# Altium schematic sheet SHEET_MAIN.SchDoc
size 381 x 241 mm
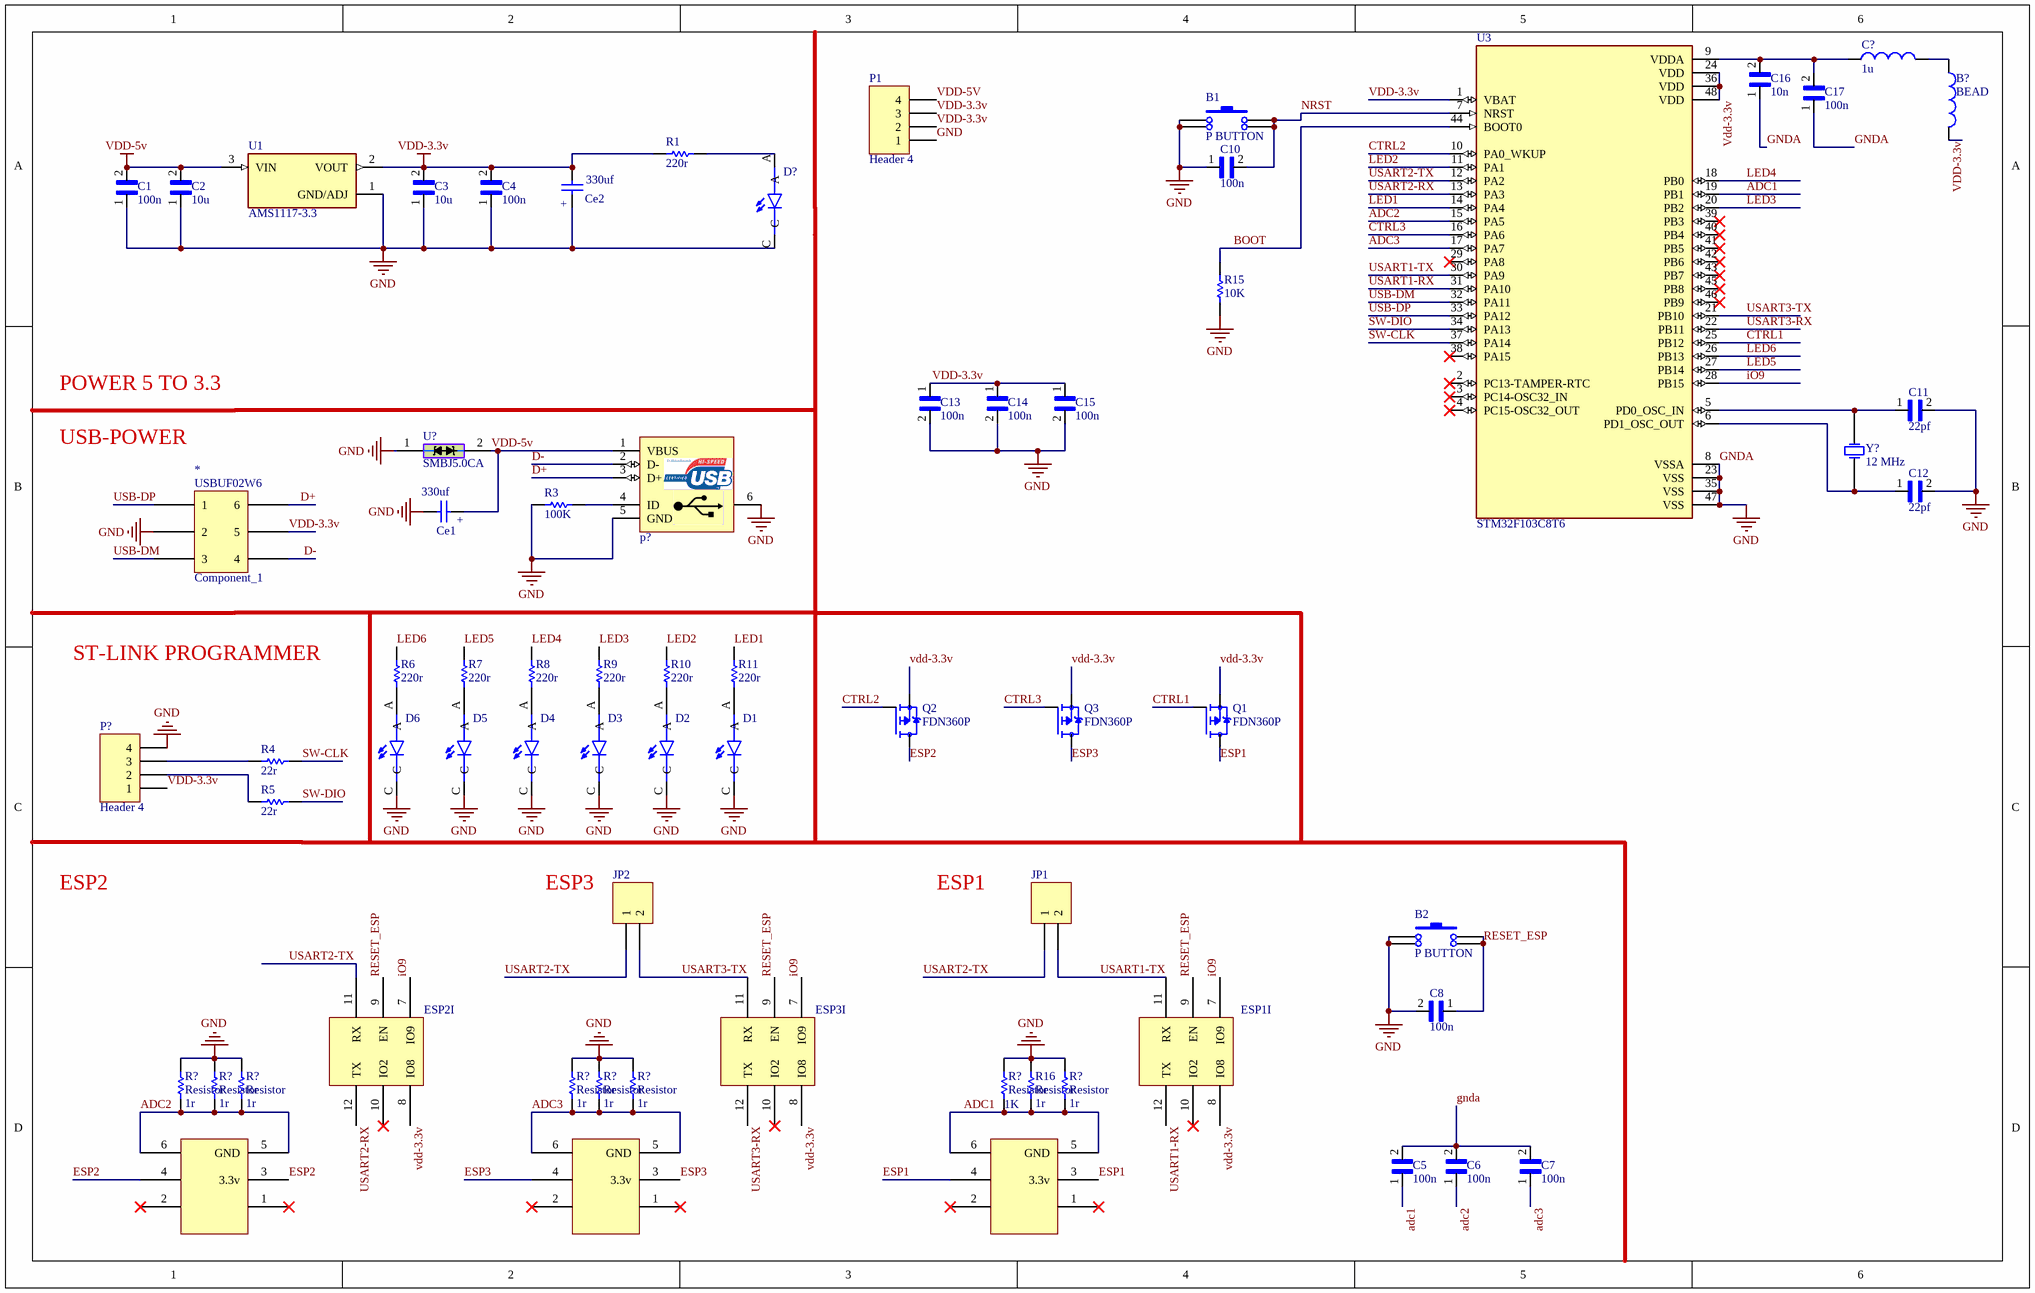
[diagram p0: SHEET_MAIN.SchDoc]

## Parts
(Parts that share a designator on the sheet are numbered #1, #2 ... from top to bottom, then left to right.)
*  Component_1  [PCBComponent_1]
B1  P BUTTON  [SMD_PUSH_4PIN]
B2  P BUTTON  [SMD_PUSH_4PIN]
B?  BEAD  [RES 0805 (2012X06L)]
C1  100n  [CAPC2012X145N]
C2  10u  [CAPC2012X145N]
C3  10u  [CAPC2012X145N]
C4  100n  [CAPC2012X145N]
C5  100n  [CAPC2012X145N]
C6  100n  [CAPC2012X145N]
C7  100n  [CAPC2012X145N]
C8  100n  [CAPC2012X145N]
C10  100n  [CAPC2012X145N]
C11  22pf  [CAPC2012X145N]
C12  22pf  [CAPC2012X145N]
C13  100n  [CAPC2012X145N]
C14  100n  [CAPC2012X145N]
C15  100n  [CAPC2012X145N]
C16  10n  [CAPC2012X145N]
C17  100n  [CAPC2012X145N]
C?  1u  [IND0805]
Ce1  330uf  [MY_CAP_POL 8MM]
Ce2  330uf  [MY_CAP_POL 8MM]
D1  SML-LXT0805IW-TR  [LEDC2012X120N]  (value not drawn)
D2  SML-LXT0805IW-TR  [LEDC2012X120N]  (value not drawn)
D3  SML-LXT0805IW-TR  [LEDC2012X120N]  (value not drawn)
D4  SML-LXT0805IW-TR  [LEDC2012X120N]  (value not drawn)
D5  SML-LXT0805IW-TR  [LEDC2012X120N]  (value not drawn)
D6  SML-LXT0805IW-TR  [LEDC2012X120N]  (value not drawn)
D?  SML-LXT0805IW-TR  [LEDC2012X120N]  (value not drawn)
ESP1  (no value)  [PCBComponent_1]  (part I of 9)
ESP2  (no value)  [PCBComponent_1]  (part I of 9)
ESP3  (no value)  [PCBComponent_1]  (part I of 9)
JP1  Jumper 2Pin  [Jumper Small - 2.54 - Black]  (value not drawn)
JP2  Jumper 2Pin  [Jumper Small - 2.54 - Black]  (value not drawn)
P1  Header 4  [HDR1X4]
p?#1  USB Connector  [USB_AB_receptacle]  (value not drawn)
P?#2  Header 4  [HDR1X4]
Q1  FDN360P  [SOT95P251X112-3N]
Q2  FDN360P  [SOT95P251X112-3N]
Q3  FDN360P  [SOT95P251X112-3N]
R1  value 220r  [Resistor_SMD_0805]  (hidden comment: Resistor 0.25w)
R3  value 100K  [Resistor_SMD_0805]  (hidden comment: Resistor 0.25w)
R4  value 22r  [Resistor_SMD_0805]  (hidden comment: Resistor 0.25w)
R5  value 22r  [Resistor_SMD_0805]  (hidden comment: Resistor 0.25w)
R6  value 220r  [Resistor_SMD_0805]  (hidden comment: Resistor 0.25w)
R7  value 220r  [Resistor_SMD_0805]  (hidden comment: Resistor 0.25w)
R8  value 220r  [Resistor_SMD_0805]  (hidden comment: Resistor 0.25w)
R9  value 220r  [Resistor_SMD_0805]  (hidden comment: Resistor 0.25w)
R10  value 220r  [Resistor_SMD_0805]  (hidden comment: Resistor 0.25w)
R11  value 220r  [Resistor_SMD_0805]  (hidden comment: Resistor 0.25w)
R15  value 10K  [Resistor_SMD_0805]  (hidden comment: Resistor 0.25w)
R16  Resistor  value 1r  [Resistor_SMD_1206 (3216)]
R?#1  Resistor  value 1r  [Resistor_SMD_1206 (3216)]
R?#2  Resistor  value 1r  [Resistor_SMD_1206 (3216)]
R?#3  Resistor  value 1r  [Resistor_SMD_1206 (3216)]
R?#4  Resistor  value 1r  [Resistor_SMD_1206 (3216)]
R?#5  Resistor  value 1r  [Resistor_SMD_1206 (3216)]
R?#6  Resistor  value 1r  [Resistor_SMD_1206 (3216)]
R?#7  Resistor  value 1K  [Resistor_SMD_1206 (3216)]
R?#8  Resistor  value 1r  [Resistor_SMD_1206 (3216)]
U1  AMS1117-3.3  [SOT229P700X180-4N]
U3  STM32F103C8T6  [QFP50P900X900X160-48N]
U?  SMBJ5.0CA  [DO-214AC]
Y?  12 MHz  [Crystal SMD]

## Nets
GND: *.?2(2) B1.1 B1.4 B2.1 B2.4 C1.1 C2.1 C3.1 C4.1 C5.2 C6.2 C7.2 C8.2 C10.1 C11.2 C12.2 C13.2 C14.2 C15.2 C16.1 C17.1 Ce1.- Ce2.+ D1.C D2.C D3.C D4.C D5.C D6.C D?.C P1.1 p?#1.5(GND) p?#1.6(MH) P?#2.4 R3.1 R15.1 R16.2 R?#1.2 R?#2.2 R?#3.2 R?#4.2 R?#5.2 R?#6.2 R?#7.2 R?#8.2 U1.1(GND/ADJ) U3.8(VSSA) U3.23(VSS) U3.35(VSS) U3.47(VSS) U?.1  [also labelled GNDA]
VDD-3.3v: *.?5(5) B?.2 C3.2 C4.2 C13.1 C14.1 C15.1 Ce2.- ESP1.8(IO8) ESP2.8(IO8) ESP3.8(IO8) P1.2 P1.3 P?#2.1 Q1.2(S) Q2.2(S) Q3.2(S) R1.1 U1.2(VOUT) U3.1(VBAT) U3.24(VDD) U3.36(VDD) U3.48(VDD)
VDD-5v: C1.2 C2.2 Ce1.+ P1.4 p?#1.1(VBUS) U1.3(VIN) U?.2
ADC1: C5.1 ESP1.5(GND) ESP1.6 R16.1 R?#7.1 R?#8.1 U3.19(PB1)
ADC2: C6.1 ESP2.5(GND) ESP2.6 R?#1.1 R?#2.1 R?#3.1 U3.15(PA5)
ADC3: C7.1 ESP3.5(GND) ESP3.6 R?#4.1 R?#5.1 R?#6.1 U3.17(PA7)
BOOT: R15.2 U3.44(BOOT0)
CTRL1: Q1.1(G) U3.25(PB12)
CTRL2: Q2.1(G) U3.10(PA0_WKUP)
CTRL3: Q3.1(G) U3.16(PA6)
D+: *.?6(6) p?#1.3(D+)
D-: *.?4(4) p?#1.2(D-)
ESP1: ESP1.3(3.3v) ESP1.4 Q1.3(D)
ESP2: ESP2.3(3.3v) ESP2.4 Q2.3(D)
ESP3: ESP3.3(3.3v) ESP3.4 Q3.3(D)
iO9: ESP1.7(IO9) ESP2.7(IO9) ESP3.7(IO9) U3.28(PB15)
LED1: R11.2 U3.14(PA4)
LED2: R10.2 U3.11(PA1)
LED3: R9.2 U3.20(PB2)
LED4: R8.2 U3.18(PB0)
LED5: R7.2 U3.27(PB14)
LED6: R6.2 U3.26(PB13)
NRST: B1.2 B1.3 C10.2 U3.7(NRST)
RESET_ESP: B2.2 B2.3 C8.1 ESP1.9(EN) ESP2.9(EN) ESP3.9(EN)
SW-CLK: R4.2 U3.37(PA14)
SW-DIO: R5.2 U3.34(PA13)
USART1-RX: ESP1.12(TX) U3.31(PA10)
USART1-TX: ESP1.11(RX) JP1.2 U3.30(PA9)
USART2-RX: ESP2.12(TX) U3.13(PA3)
USART2-TX: ESP2.11(RX) JP1.1 JP2.1 U3.12(PA2)
USART3-RX: ESP3.12(TX) U3.22(PB11)
USART3-TX: ESP3.11(RX) JP2.2 U3.21(PB10)
USB-DM: *.?3(3) U3.32(PA11)
USB-DP: *.?1(1) U3.33(PA12)
NetB?_1: B?.1 C?.2
NetC11_1: C11.1 U3.5(PD0_OSC_IN) Y?.2(OSC2)
NetC12_1: C12.1 U3.6(PD1_OSC_OUT) Y?.1(OSC1)
NetC16_2: C16.2 C17.2 C?.1 U3.9(VDDA)
NetD1_A: D1.A R11.1
NetD2_A: D2.A R10.1
NetD3_A: D3.A R9.1
NetD4_A: D4.A R8.1
NetD5_A: D5.A R7.1
NetD6_A: D6.A R6.1
NetD?_A: D?.A R1.2
Netp?#1_4: p?#1.4(ID) R3.2
NetP?#2_2: P?#2.2 R5.1
NetP?#2_3: P?#2.3 R4.1

Not connected (* = marked no-connect by the designer): ESP1 1* 2* 10(IO2)*; ESP2 1* 2* 10(IO2)*; ESP3 1* 2* 10(IO2)*; U3 2(PC13-TAMPER-RTC)* 3(PC14-OSC32_IN)* 4(PC15-OSC32_OUT)* 29(PA8)* 38(PA15)* 39(PB3)* 40(PB4)* 41(PB5)* 42(PB6)* 43(PB7)* 45(PB8)* 46(PB9)*

## Notes on the sheet
- POWER 5 TO 3.3
- USB-POWER
- ST-LINK PROGRAMMER
- ESP2
- (near JP2) ESP3
- ESP1
- (in symbol Component_1) USBUF02W6
- (in symbol USB AB MICRO CONNECTOR) D:AbbasBasereh

## Library data of the parts
B1 B2 = PUSH BUTTON_SMD-4PIN
B? = FERIT BEAD: FERIT BEAD SMD 1206
C1-C8 C10-C17 = VJ0805D820GXCAP: Package: None; Price: None; Value: *; MP: VJ0805D820GXCAP; Availability: Unavailable
C? = INDUCTOR SMD PACKAGE: TOTAL INDUCTOR SMD PACK; Designer: Abbas Basereh; Desc.: INDUCTOR  SMD TOTAL PACKAGES; Data: 2017-3-10; VALUE: 1u
Ce1 Ce2 = Cap Pol_8mm: cap-330uf; Value: 3300u
D1-D6 D? = SML-LXT0805IW-TR: Red - LED Indication - Discrete 2V 0805 (2012 Metric); MF: Lumex Opto/Components; Check_prices: https://www.snapeda.com/parts/SML-LXT0805IW-TR/Lumex+Opto%252FComponents+Inc./view-part/?ref=eda; Price: None; MP: SML-LXT0805IW-TR; SnapEDA_Link: https://www.snapeda.com/parts/SML-LXT0805IW-TR/Lumex+Opto%252FComponents+Inc./view-part/?ref=snap; Availability: In Stock; Value: *; Purchase-URL: https://pricing.snapeda.com/search/part/SML-LXT0805IW-TR/?ref=eda; Package: 0805 Lumex
ESP1-ESP3 = Component_1
JP1 JP2 = Jumper 2Pin: Jumper, 2-Pin; Designer: Abbas Basereh; Data: 16-12-2016; Link: *
P1 P?#2 = Header 4: Header, 4-Pin; LatestRevisionDate: 17-Jul-2002; LatestRevisionNote: Re-released for DXP Platform.; Publisher: Altium Limited
p?#1 = USB AB MICRO CONNECTOR: USB MICRO-B Type Connector; Designer: ABBAS BASEREH; Max Current: 1600mA; Mounting Technology: Surface Mount\Through-Hole; Category: Connector; Pin Count: 5-7; Publisher: ABBAS BASEREH; Status: Unreleased; ComponentLink1Description: Datasheet; ComponentLink2Description: Reference; Update: 1395-11-17
Q1-Q3 = FDN360P: P-Channel 30V 2A (Ta) 500mW (Ta) Surface Mount SuperSOT-3; MF: ON; Value: *; Package: TO-236-3 ON; Check_prices: https://www.snapeda.com/parts/FDN360P/Onsemi/view-part/?ref=eda; Price: None; MP: FDN360P; Availability: In Stock; SnapEDA_Link: https://www.snapeda.com/parts/FDN360P/Onsemi/view-part/?ref=snap; Purchase-URL: https://pricing.snapeda.com/search/part/FDN360P/?ref=eda
R1 R3-R11 R15 = Resistor: LatestRevisionDate: 17-Jul-2002; LatestRevisionNote: Re-released for DXP Platform.; Publisher: Altium Limited
R16 R?#1-R?#8 = Resistor: Email: razi.vesali@gmail.com; Published: 17-Jun-2016; LatestRevisionNote: Re-released for puplic; Publisher: Seyed Razi Vesali
U1 = AMS1117-3.3: Sot223/Pkg 1-Amp 3.3-Volt Low Drop Out Voltage Regulatator; MF: Advanced Monolithic Systems; Package: SOT-223 Seeed Technology; Value: *; Check_prices: https://www.snapeda.com/parts/AMS1117-3.3/Advanced+Monolithic+Systems/view-part/?ref=eda; Price: None; Availability: Not in stock; MP: AMS1117-3.3; SnapEDA_Link: https://www.snapeda.com/parts/AMS1117-3.3/Advanced+Monolithic+Systems/view-part/?ref=snap
U3 = STM32F103C8T6: ARMÂ® CortexÂ®-M3 STM32F1 Microcontroller IC 32-Bit 72MHz 64KB (64K x 8) FLASH 48-LQFP (7x7); MF: STMicroelectronics; Package: LQFP-48 STMicroelectronics; Price: None; Check_prices: https://www.snapeda.com/parts/STM32F103C8T6/STMicroelectronics/view-part/?ref=eda; Value: *; SnapEDA_Link: https://www.snapeda.com/parts/STM32F103C8T6/STMicroelectronics/view-part/?ref=snap; MP: STM32F103C8T6; Availability: In Stock; Purchase-URL: https://pricing.snapeda.com/search/part/STM32F103C8T6/?ref=eda
U? = SMBJ5.0CA: TVS Diode for 5v; Link: javanElectronic; Price: 2625 Rial
Y? = XTAL_Crystal: XTAL Crystal; Designer: ABBAS BASEREH; Design Date: 2017-1-3; ComponentLink1Description: Datasheet; ComponentLink2Description: Reference; Mounting Technology: Surface Mount\Through-Hole; Value: 12 MHz; Status: Unreleased